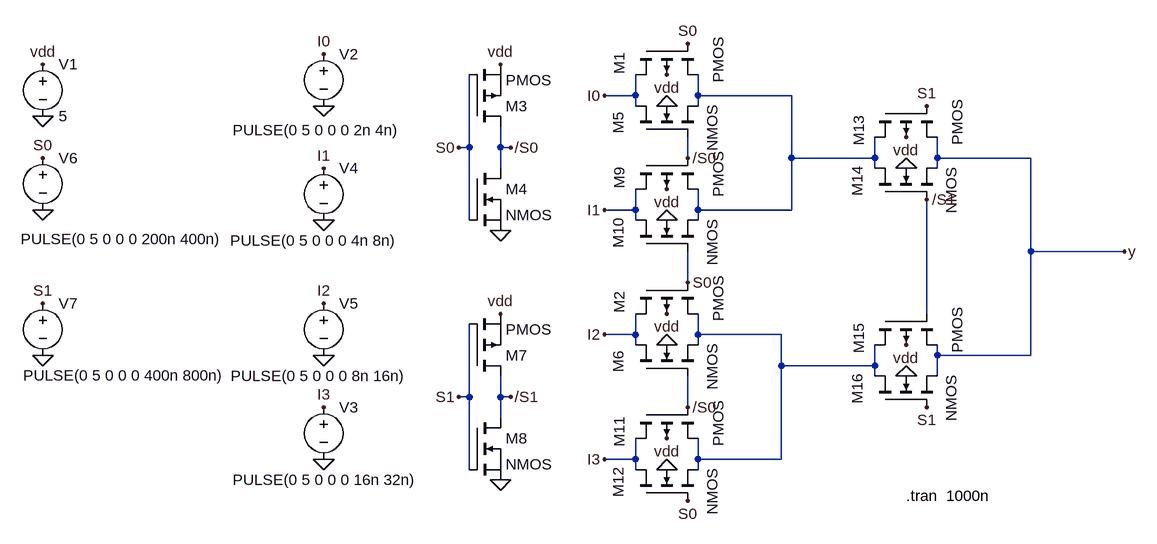
[diagram p0: schematic MUX4.1.asc]
MUX4.1.asc, the LTspice schematic file:
Version 4
SHEET 1 880 680
WIRE -16 -688 -16 -720
WIRE -16 -688 -64 -688
WIRE 80 -688 80 -720
WIRE 224 -688 80 -688
WIRE -16 -672 -16 -688
WIRE 80 -672 80 -688
WIRE -272 -608 -272 -720
WIRE -272 -608 -288 -608
WIRE -224 -608 -224 -640
WIRE -208 -608 -224 -608
WIRE 64 -592 64 -624
WIRE 224 -592 224 -688
WIRE 352 -592 352 -624
WIRE 352 -592 224 -592
WIRE 448 -592 448 -624
WIRE 592 -592 448 -592
WIRE -224 -576 -224 -608
WIRE 352 -576 352 -592
WIRE 448 -576 448 -592
WIRE -16 -512 -16 -544
WIRE -16 -512 -64 -512
WIRE 80 -512 80 -544
WIRE 224 -512 224 -592
WIRE 224 -512 80 -512
WIRE -272 -496 -272 -608
WIRE -16 -496 -16 -512
WIRE 80 -496 80 -512
WIRE 592 -448 592 -592
WIRE 736 -448 592 -448
WIRE 64 -400 64 -448
WIRE 432 -352 432 -528
WIRE -16 -320 -16 -352
WIRE -16 -320 -64 -320
WIRE 80 -320 80 -352
WIRE 208 -320 80 -320
WIRE -16 -304 -16 -320
WIRE 80 -304 80 -320
WIRE 448 -288 448 -304
WIRE 592 -288 592 -448
WIRE 592 -288 448 -288
WIRE 208 -272 208 -320
WIRE 352 -272 352 -304
WIRE 352 -272 208 -272
WIRE 352 -256 352 -272
WIRE 448 -256 448 -288
WIRE -272 -224 -272 -336
WIRE -272 -224 -288 -224
WIRE -224 -224 -224 -256
WIRE -208 -224 -224 -224
WIRE 64 -208 64 -256
WIRE -224 -192 -224 -224
WIRE -16 -128 -16 -160
WIRE -16 -128 -64 -128
WIRE 80 -128 80 -160
WIRE 208 -128 208 -272
WIRE 208 -128 80 -128
WIRE -272 -112 -272 -224
WIRE -16 -112 -16 -128
WIRE 80 -112 80 -128
FLAG -928 -736 vdd
FLAG 32 -720 vdd
FLAG -496 -752 I0
FLAG -496 -576 I1
FLAG -496 -368 I2
FLAG -496 -208 I3
FLAG -928 -592 S0
FLAG 32 -672 0
FLAG 32 -544 vdd
FLAG 32 -496 0
FLAG 32 -352 vdd
FLAG 32 -304 0
FLAG 32 -160 vdd
FLAG 32 -112 0
FLAG 400 -624 vdd
FLAG 400 -576 0
FLAG 400 -304 vdd
FLAG 400 -256 0
FLAG -928 -656 0
FLAG -496 -672 0
FLAG -496 -128 0
FLAG -496 -288 0
FLAG -496 -496 0
FLAG -928 -288 0
FLAG -928 -512 0
FLAG -928 -368 S1
FLAG -224 -736 vdd
FLAG -224 -352 vdd
FLAG -288 -224 S1
FLAG -288 -608 S0
FLAG -208 -608 /S0
FLAG -208 -224 /S1
FLAG -64 -688 I0
FLAG -64 -512 I1
FLAG -64 -320 I2
FLAG -64 -128 I3
FLAG 64 -64 S0
FLAG 64 -768 S0
FLAG 64 -400 S0
FLAG 64 -208 /S0
FLAG 64 -592 /S0
FLAG 432 -672 S1
FLAG 432 -208 S1
FLAG 432 -528 /S1
FLAG -224 -480 0
FLAG -224 -96 0
FLAG 736 -448 y
SYMBOL pmos4 -16 -768 M90
WINDOW 0 14 -25 Left 2
WINDOW 3 -10 127 Left 2
SYMATTR InstName M1
SYMBOL nmos4 -16 -624 R270
WINDOW 0 5 -27 Left 2
WINDOW 3 -22 118 Left 2
SYMATTR InstName M5
SYMBOL voltage -928 -752 R0
WINDOW 123 0 0 Left 0
WINDOW 39 0 0 Left 0
SYMATTR InstName V1
SYMATTR Value 5
SYMBOL voltage -496 -768 R0
WINDOW 3 -140 133 Left 2
WINDOW 123 0 0 Left 0
WINDOW 39 0 0 Left 0
SYMATTR Value PULSE(0 5 0 0 0 2n 4n)
SYMATTR InstName V2
SYMBOL voltage -496 -224 R0
WINDOW 3 -140 128 Left 2
WINDOW 123 0 0 Left 0
WINDOW 39 0 0 Left 0
SYMATTR Value PULSE(0 5 0 0 0 16n 32n)
SYMATTR InstName V3
SYMBOL voltage -496 -592 R0
WINDOW 3 -144 127 Left 2
WINDOW 123 0 0 Left 0
WINDOW 39 0 0 Left 0
SYMATTR Value PULSE(0 5 0 0 0 4n 8n)
SYMATTR InstName V4
SYMBOL voltage -496 -384 R0
WINDOW 3 -143 128 Left 2
WINDOW 123 0 0 Left 0
WINDOW 39 0 0 Left 0
SYMATTR Value PULSE(0 5 0 0 0 8n 16n)
SYMATTR InstName V5
SYMBOL voltage -928 -608 R0
WINDOW 3 -34 141 Left 2
WINDOW 123 0 0 Left 0
WINDOW 39 0 0 Left 0
SYMATTR Value PULSE(0 5 0 0 0 200n 400n)
SYMATTR InstName V6
SYMBOL voltage -928 -384 R0
WINDOW 3 -30 127 Left 2
WINDOW 123 0 0 Left 0
WINDOW 39 0 0 Left 0
SYMATTR Value PULSE(0 5 0 0 0 400n 800n)
SYMATTR InstName V7
SYMBOL pmos4 -16 -592 M90
WINDOW 0 14 -25 Left 2
WINDOW 3 -10 127 Left 2
SYMATTR InstName M9
SYMBOL nmos4 -16 -448 R270
WINDOW 0 5 -27 Left 2
WINDOW 3 -22 118 Left 2
SYMATTR InstName M10
SYMBOL pmos4 -16 -400 M90
WINDOW 0 14 -25 Left 2
WINDOW 3 -10 127 Left 2
SYMATTR InstName M2
SYMBOL nmos4 -16 -256 R270
WINDOW 0 5 -27 Left 2
WINDOW 3 -22 118 Left 2
SYMATTR InstName M6
SYMBOL pmos4 -16 -208 M90
WINDOW 0 14 -25 Left 2
WINDOW 3 -10 127 Left 2
SYMATTR InstName M11
SYMBOL nmos4 -16 -64 R270
WINDOW 0 5 -27 Left 2
WINDOW 3 -22 118 Left 2
SYMATTR InstName M12
SYMBOL pmos4 352 -672 M90
WINDOW 0 14 -25 Left 2
WINDOW 3 -10 127 Left 2
SYMATTR InstName M13
SYMBOL nmos4 352 -528 R270
WINDOW 0 5 -27 Left 2
WINDOW 3 -22 118 Left 2
SYMATTR InstName M14
SYMBOL pmos4 352 -352 M90
WINDOW 0 14 -25 Left 2
WINDOW 3 -10 127 Left 2
SYMATTR InstName M15
SYMBOL nmos4 352 -208 R270
WINDOW 0 5 -27 Left 2
WINDOW 3 -22 118 Left 2
SYMATTR InstName M16
SYMBOL pmos -272 -640 M180
SYMATTR InstName M3
SYMBOL nmos -272 -576 R0
SYMATTR InstName M4
SYMBOL pmos -272 -256 M180
SYMATTR InstName M7
SYMBOL nmos -272 -192 R0
SYMATTR InstName M8
TEXT 400 -72 Left 2 !.tran  1000n

The netlist it stands for:
* MUX4.1.asc
M1 I0 S0 N001 vdd PMOS
M5 I0 /S0 N001 0 NMOS
V1 vdd 0 5
V2 I0 0 PULSE(0 5 0 0 0 2n 4n)
V3 I3 0 PULSE(0 5 0 0 0 16n 32n)
V4 I1 0 PULSE(0 5 0 0 0 4n 8n)
V5 I2 0 PULSE(0 5 0 0 0 8n 16n)
V6 S0 0 PULSE(0 5 0 0 0 200n 400n)
V7 S1 0 PULSE(0 5 0 0 0 400n 800n)
M9 I1 /S0 N001 vdd PMOS
M10 I1 S0 N001 0 NMOS
M2 I2 S0 N002 vdd PMOS
M6 I2 /S0 N002 0 NMOS
M11 I3 /S0 N002 vdd PMOS
M12 I3 S0 N002 0 NMOS
M13 N001 S1 y vdd PMOS
M14 N001 /S1 y 0 NMOS
M15 N002 /S1 y vdd PMOS
M16 N002 S1 y 0 NMOS
M3 /S0 S0 vdd vdd PMOS
M4 /S0 S0 0 0 NMOS
M7 /S1 S1 vdd vdd PMOS
M8 /S1 S1 0 0 NMOS
.model NMOS NMOS
.model PMOS PMOS
.lib standard.mos
.tran  1000n
.backanno
.end